# EAGLE schematic DMB-4770-8-IN-8-OUT (EAGLE 6.5.0)
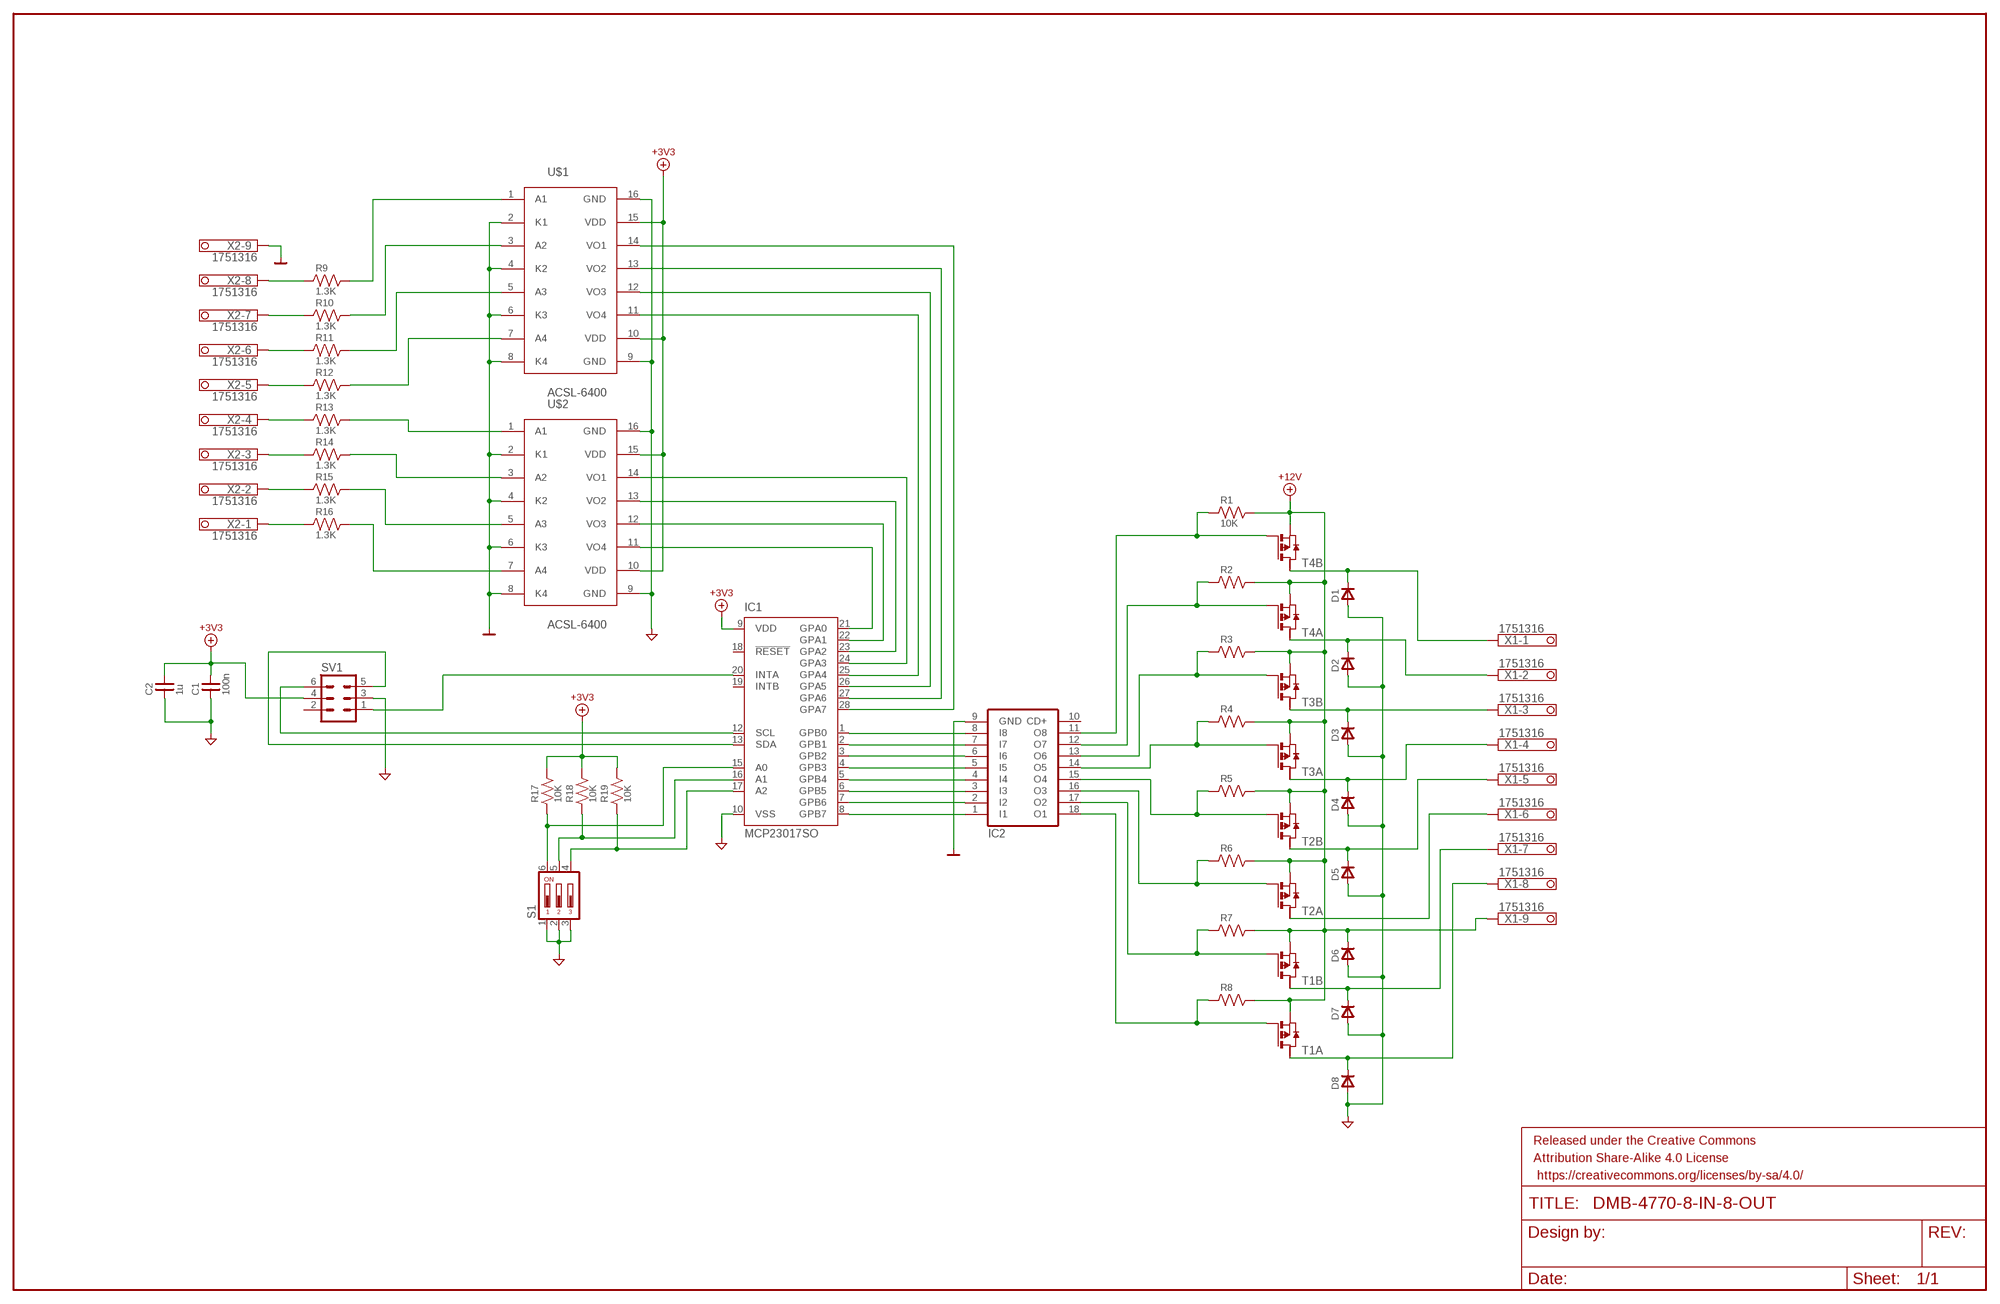
[diagram p0: schematic, sheet 1]

## Parts
C1  100n  C0805  [C0805]
C2  1u  C0805  [C0805]
D1  DSMA  [DSMA]
D2  DSMA  [DSMA]
D3  DSMA  [DSMA]
D4  DSMA  [DSMA]
D5  DSMA  [DSMA]
D6  DSMA  [DSMA]
D7  DSMA  [DSMA]
D8  DSMA  [DSMA]
FRAME1  FRAME-LEDGER  [CREATIVE_COMMONS]
IC1  MCP23017SO  [SO28W]
IC2  ULN2803A  [DIL18]
R1  10K  RU0805  [R0805]
R2  RU0805  [R0805]
R3  RU0805  [R0805]
R4  RU0805  [R0805]
R5  RU0805  [R0805]
R6  RU0805  [R0805]
R7  RU0805  [R0805]
R8  RU0805  [R0805]
R9  1.3K  RU0805  [R0805]
R10  1.3K  RU0805  [R0805]
R11  1.3K  RU0805  [R0805]
R12  1.3K  RU0805  [R0805]
R13  1.3K  RU0805  [R0805]
R14  1.3K  RU0805  [R0805]
R15  1.3K  RU0805  [R0805]
R16  1.3K  RU0805  [R0805]
R17  10K  RU0805  [R0805]
R18  10K  RU0805  [R0805]
R19  10K  RU0805  [R0805]
S1  DIP03YL  [DIP03YL]
SV1  ML6  [ML6]
T1  PMOS2SO8  [SO8]
T2  PMOS2SO8  [SO8]
T3  PMOS2SO8  [SO8]
T4  PMOS2SO8  [SO8]
U$1  ACSL-6400  [SO16]
U$2  ACSL-6400  [SO16]
X1  1751316  [1751316]
X2  1751316  [1751316]

## Nets
+3V3: C1.2 C2.2 IC1.9(VDD) R17.2 R18.2 R19.2 SV1.4 U$1.10(VDD) U$1.15(VDD) U$2.10(VDD) U$2.15(VDD) ; supply symbol labelled V+3V3
+12V: D6.C R1.2 R2.2 R3.2 R4.2 R5.2 R6.2 R7.2 R8.2 T1.1(A:S) T1.3(B:S) T2.1(A:S) T2.3(B:S) T3.1(A:S) T3.3(B:S) T4.1(A:S) T4.3(B:S) X1.9 ; supply symbol labelled V+12-24VV
DGND: C1.1 C2.1 D1.A D2.A D3.A D4.A D5.A D6.A D7.A D8.A IC1.10(VSS) S1.1 S1.2 S1.3 SV1.3 U$1.9(GND) U$1.16(GND) U$2.9(GND) U$2.16(GND) ; supply symbol labelled VDG
GND: IC2.9(GND) U$1.2(K1) U$1.4(K2) U$1.6(K3) U$1.8(K4) U$2.2(K1) U$2.4(K2) U$2.6(K3) U$2.8(K4) X2.9 ; supply symbol labelled VG
N$1: IC2.16(O3) R6.1 T2.2(A:G)
N$2: IC2.11(O8) R1.1 T4.4(B:G)
N$3: IC2.12(O7) R2.1 T4.2(A:G)
N$4: IC2.13(O6) R3.1 T3.4(B:G)
N$5: IC2.14(O5) R4.1 T3.2(A:G)
N$6: IC2.15(O4) R5.1 T2.4(B:G)
N$7: IC2.17(O2) R7.1 T1.4(B:G)
N$8: IC2.18(O1) R8.1 T1.2(A:G)
N$10: D1.C T4.6(B:D) X1.1
N$11: D2.C T4.7(A:D) X1.2
N$12: IC1.1(GPB0) IC2.8(I8)
N$13: IC1.2(GPB1) IC2.7(I7)
N$14: IC1.3(GPB2) IC2.6(I6)
N$15: IC1.4(GPB3) IC2.5(I5)
N$16: IC1.5(GPB4) IC2.4(I4)
N$17: IC1.6(GPB5) IC2.3(I3)
N$18: IC1.7(GPB6) IC2.2(I2)
N$19: IC1.8(GPB7) IC2.1(I1)
N$20: D3.C T3.6(B:D) X1.3
N$21: D4.C T3.7(A:D) X1.4
N$22: D5.C T2.6(B:D) X1.5
N$23: T2.7(A:D) X1.6
N$24: D7.C T1.6(B:D) X1.7
N$25: D8.C T1.7(A:D) X1.8
N$26: R9.1 X2.8
N$27: R10.1 X2.7
N$28: R11.1 X2.6
N$29: R12.1 X2.5
N$30: R13.1 X2.4
N$31: R14.1 X2.3
N$32: R15.1 X2.2
N$33: R16.1 X2.1
N$34: R9.2 U$1.1(A1)
N$35: R10.2 U$1.3(A2)
N$36: R11.2 U$1.5(A3)
N$37: R12.2 U$1.7(A4)
N$38: R13.2 U$2.1(A1)
N$39: R14.2 U$2.3(A2)
N$40: R15.2 U$2.5(A3)
N$41: R16.2 U$2.7(A4)
N$44: IC1.21(GPA0) U$2.11(VO4)
N$45: IC1.22(GPA1) U$2.12(VO3)
N$46: IC1.23(GPA2) U$2.13(VO2)
N$47: IC1.24(GPA3) U$2.14(VO1)
N$48: IC1.25(GPA4) U$1.11(VO4)
N$49: IC1.26(GPA5) U$1.12(VO3)
N$50: IC1.27(GPA6) U$1.13(VO2)
N$51: IC1.28(GPA7) U$1.14(VO1)
N$53: IC1.17(A2) R19.1 S1.4
N$54: IC1.16(A1) R18.1 S1.5
N$55: IC1.15(A0) R17.1 S1.6
N$57: IC1.12(SCL) SV1.6
N$58: IC1.13(SDA) SV1.5
N$59: IC1.20(INTA) SV1.1
Unconnected: IC1.18(!RESET) IC1.19(INTB) IC2.10(CD+) SV1.2 T1.5(B:D2) T1.8(A:D2) T2.5(B:D2) T2.8(A:D2) T3.5(B:D2) T3.8(A:D2) T4.5(B:D2) T4.8(A:D2)

## Library data of the parts
C1 C2 = divers:C: Capacitor bipolar
D1-D8 = diodes:D: Diode
FRAME1 = SparkFun-Aesthetics:FRAME-LEDGER: Schematic Frame Standard 11x14 US Ledger frame
IC1 = microchip:MCP23017: http://ww1.microchip.com/downloads/en/DeviceDoc/21952a.pdf Source: http://ww1.microchip.com/downloads/en/DeviceDoc/21952a.pdf; MF: MICROCHIP; MPN: MCP23017-E/SO; OC_FARNELL: 1332087; OC_NEWARK: 31K2958
IC2 = uln-udn:ULN2803A: DRIVER ARRAY
R1-R19 = divers:RU: Resistor, US symbol
S1 = switch-dil:DIP03YL: DIL/CODE SWITCH; OC_FARNELL: unknown; OC_NEWARK: unknown
SV1 = con-harting-ml:ML6: HARTING; OC_FARNELL: unknown; OC_NEWARK: unknown
T1-T4 = zetex:PMOS2: DUAL 30V P-CHANNEL ENHANCEMENT MODE MOSFET Source: Data sheet <http://www.diodes.com/datasheets/ZXMP3A16DN8.pdf> SOP8 Source: Data sheet <http://www.diodes.com/datasheets/ZXMD63P03X.pdf> MSOP8; OC_FARNELL: unknown; OC_NEWARK: unknown
U$1 U$2 = avago:ACSL-6400
X1 X2 = con-phoenix-350:1751316: MKDS 1/ 9-3,5 Printklemme Nennstrom: 10 A Bemessungsspannung: 160 V Raster: 3,5 mm Polzahl: 9 Montageart: Löten Anschlussart: Schraubanschluss Anschlussrichtung vom Leiter zur Platine: 0° Source: http://eshop.phoenixcontact.com .. 1751316.pdf; OC_FARNELL: unknown; OC_NEWARK: unknown